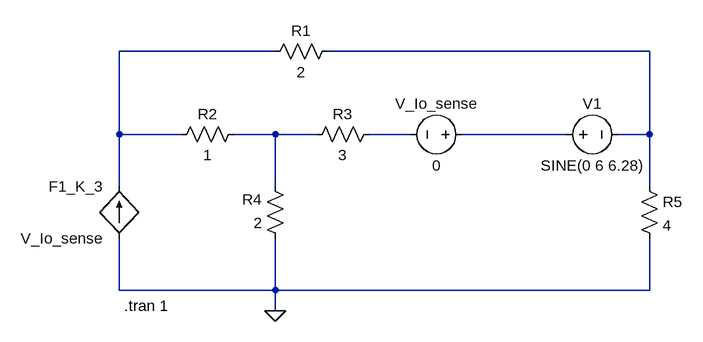
[diagram p0: schematic g3_p13.asc]
g3_p13.asc, the LTspice schematic file:
Version 4
SHEET 1 880 680
WIRE 144 48 -96 48
WIRE 720 48 224 48
WIRE -96 176 -96 48
WIRE 0 176 -96 176
WIRE 144 176 80 176
WIRE 208 176 144 176
WIRE 352 176 288 176
WIRE 592 176 432 176
WIRE 720 176 720 48
WIRE 720 176 672 176
WIRE -96 256 -96 176
WIRE 144 256 144 176
WIRE 720 256 720 176
WIRE -96 416 -96 336
WIRE 144 416 144 336
WIRE 144 416 -96 416
WIRE 720 416 720 336
WIRE 720 416 144 416
WIRE 144 448 144 416
FLAG 144 448 0
SYMBOL res 240 32 R90
WINDOW 0 0 56 VBottom 2
WINDOW 3 32 56 VTop 2
SYMATTR InstName R1
SYMATTR Value 2
SYMBOL res 96 160 R90
WINDOW 0 0 56 VBottom 2
WINDOW 3 32 56 VTop 2
SYMATTR InstName R2
SYMATTR Value 1
SYMBOL res 304 160 R90
WINDOW 0 0 56 VBottom 2
WINDOW 3 32 56 VTop 2
SYMATTR InstName R3
SYMATTR Value 3
SYMBOL res 160 352 R180
WINDOW 0 36 76 Left 2
WINDOW 3 36 40 Left 2
SYMATTR InstName R4
SYMATTR Value 2
SYMBOL res 704 240 R0
SYMATTR InstName R5
SYMATTR Value 4
SYMBOL voltage 576 176 R270
WINDOW 0 32 56 VTop 2
WINDOW 3 -32 56 VBottom 2
WINDOW 123 0 0 Left 0
WINDOW 39 0 0 Left 0
SYMATTR InstName V1
SYMATTR Value SINE(0 6 6.28)
SYMBOL f -96 336 R180
WINDOW 0 24 80 Left 2
WINDOW 3 24 0 Left 2
SYMATTR InstName F1_K_3
SYMATTR Value V_Io_sense
SYMATTR Value2 3
SYMBOL voltage 448 176 R90
WINDOW 0 -32 56 VBottom 2
WINDOW 3 32 56 VTop 2
WINDOW 123 0 0 Left 0
WINDOW 39 0 0 Left 0
SYMATTR InstName V_Io_sense
SYMATTR Value 0
TEXT -88 440 Left 2 !.tran 1

The netlist it stands for:
* g3_p13.asc
R1 N002 N001 2
R2 N003 N001 1
R3 N004 N003 3
R4 0 N003 2
R5 N002 0 4
V1 N005 N002 SINE(0 6 6.28)
F1_K_3 0 N001 V_Io_sense 3
V_Io_sense N005 N004 0
.tran 1
.backanno
.end